# Altium project CAN_ANAL.PrjPcb
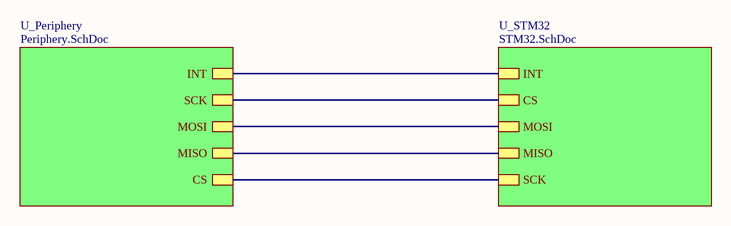
[diagram p0: main.SchDoc]
3 sheets, 55 parts. Net scope: hierarchical (ports join the sheet entries above them; power ports are global).
Board file: PCB1.PcbDoc
Sheets:
  main.SchDoc
    U_STM32 = STM32.SchDoc
    U_Periphery = Periphery.SchDoc

## Sheet main.SchDoc
size A4; SheetNumber: 1; SheetTotal: 3

### Sub-sheets
U_Periphery = Periphery.SchDoc: CS, MISO, MOSI, SCK, INT
U_STM32 = STM32.SchDoc: SCK, MISO, MOSI, CS, INT

### Nets
CS: sheet U_STM32/SCK, sheet U_Periphery/CS
INT: sheet U_STM32/INT, sheet U_Periphery/INT
MISO: sheet U_STM32/MISO, sheet U_Periphery/MISO
MOSI: sheet U_STM32/MOSI, sheet U_Periphery/MOSI
SCK: sheet U_STM32/CS, sheet U_Periphery/SCK

## Sheet STM32.SchDoc
size A4; SheetNumber: 2; SheetTotal: 3
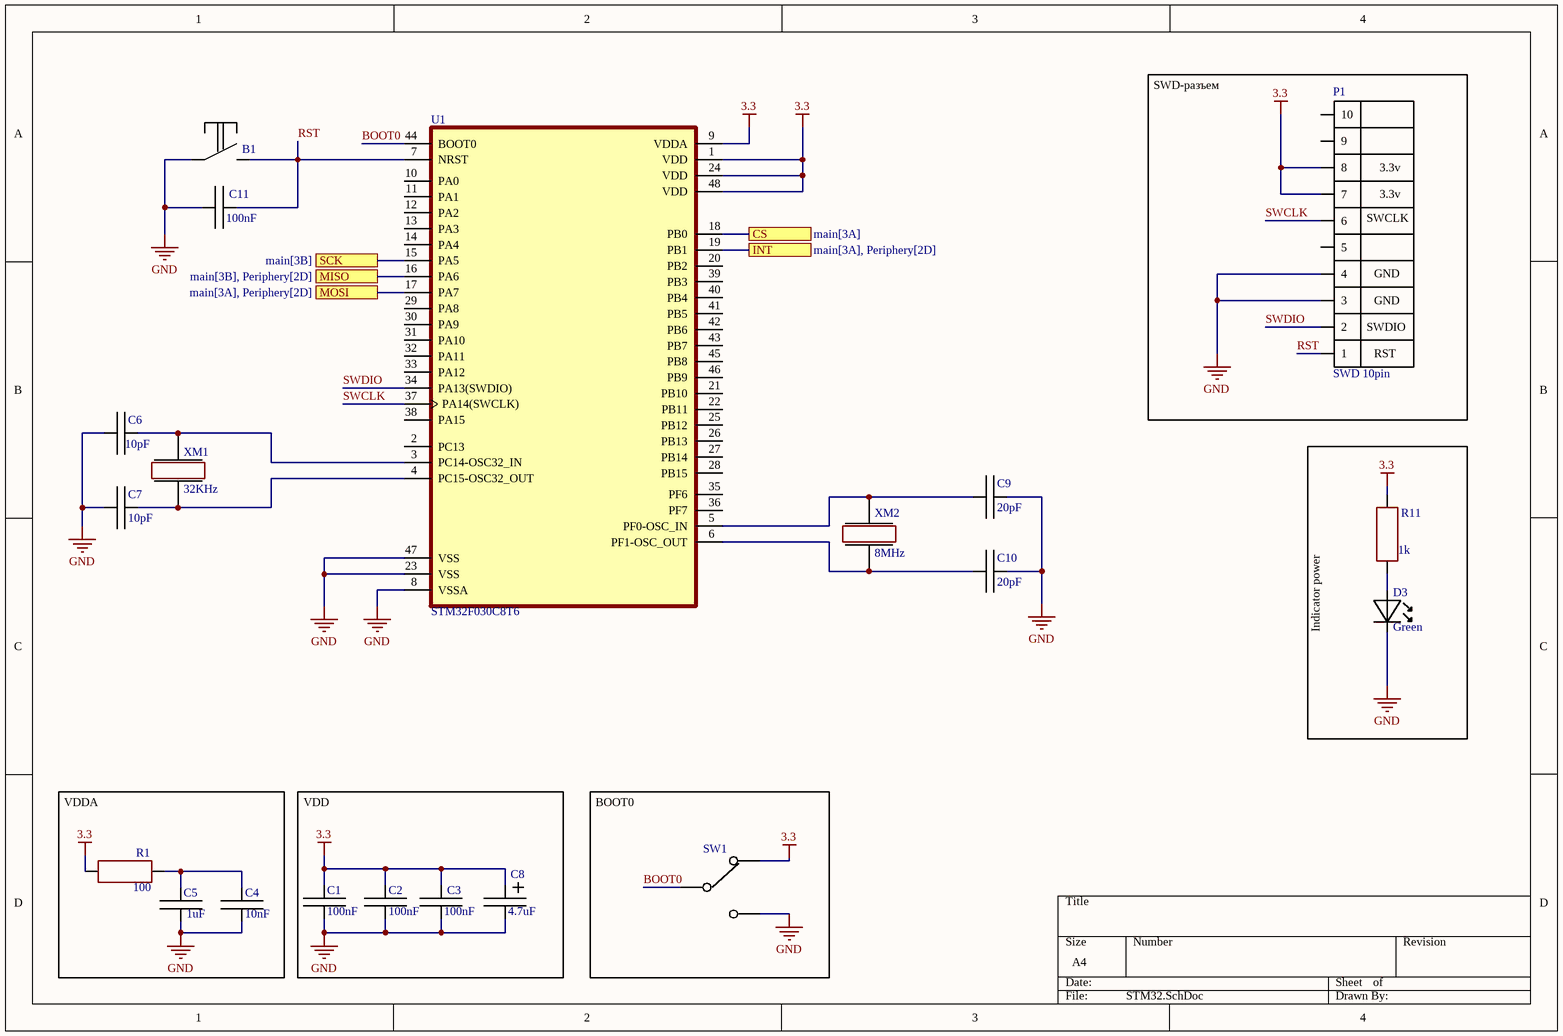
[diagram p1: STM32.SchDoc]

### Parts
B1  Knopka  [knopka]  (value not drawn)
C1  100nF  [C0805]
C2  100nF  [C0805]
C3  100nF  [C0805]
C4  10nF  [C0805]
C5  1uF  [C0805]
C6  10pF  [C0805]
C7  10pF  [C0805]
C8  4.7uF  [CAP_3.5 (8x12мм)]
C9  20pF  [C0805]
C10  20pF  [C0805]
C11  100nF  [C0805]
D3  Green  [LED0805]
P1  SWD 10pin  [SWD 10 pin]
R1  100  [R0805]
R11  1k  [R0805]
SW1  SW1  [PLS3]  (value not drawn)
U1  STM32F030C8T6  [STM32F030C8T6]
XM1  32KHz  [Resonator]
XM2  8MHz  [Resonator]

### Blocks framed on the sheet
Indicator power: D3 R11
VDDA: C4 C5 R1
VDD: C1-C3 C8
BOOT0: SW1

### Ports
CS (see main[3A]), INT (see main[3A], Periphery[2D]), MISO (see main[3B], Periphery[2D]), MOSI (see main[3A], Periphery[2D]), SCK (see main[3B])

### Nets
3.3: C1.2 C2.2 C3.2 C8.1 P1.7 P1.8 R1.2 R11.2 SW1.1 U1.1(VDD) U1.9(VDDA) U1.24(VDD) U1.48(VDD)
GND: B1.1 C1.1 C2.1 C3.1 C4.1 C5.1 C6.1 C7.1 C8.2 C9.2 C10.2 C11.1 D3.C P1.3 P1.4 SW1.3 U1.8(VSSA) U1.23(VSS) U1.47(VSS)
BOOT0: SW1.2 U1.44(BOOT0)
CS: U1.15(PA5) ; port SCK
INT: U1.19(PB1) ; port INT
MISO: U1.16(PA6) ; port MISO
MOSI: U1.17(PA7) ; port MOSI
RST: B1.2 C11.2 P1.1 U1.7(NRST)
SCK: U1.18(PB0) ; port CS
SWCLK: P1.6 U1.37(PA14(SWCLK))
SWDIO: P1.2 U1.34(PA13(SWDIO))
NetC4_2: C4.2 C5.2 R1.1
NetC6_2: C6.2 U1.3(PC14-OSC32_IN) XM1.2
NetC7_2: C7.2 U1.4(PC15-OSC32_OUT) XM1.1
NetC9_1: C9.1 U1.5(PF0-OSC_IN) XM2.2
NetC10_1: C10.1 U1.6(PF1-OSC_OUT) XM2.1
NetD3_A: D3.A R11.1

Not connected (* = marked no-connect by the designer): P1 5 9 10; U1 2(PC13) 10(PA0) 11(PA1) 12(PA2) 13(PA3) 14(PA4) 20(PB2) 21(PB10) 22(PB11) 25(PB12) 26(PB13) 27(PB14) 28(PB15) 29(PA8) 30(PA9) 31(PA10) 32(PA11) 33(PA12) 35(PF6) 36(PF7) 38(PA15) 39(PB3) 40(PB4) 41(PB5) 42(PB6) 43(PB7) 45(PB8) 46(PB9)

### Notes on the sheet
- SWD-разъем
- (near P1) 3.3v
- (near P1) SWCLK
- (near P1) GND
- (near P1) SWDIO
- (near P1) RST

### Library data of the parts
B1 = Knopka: SMD
C1-C7 C9-C11 = C0805: Керамический конденсатор. 1uF,10uF,106uF,33pF,100uF
C8 = C_3.5: Электролит конденсатор (8x12мм)
D3 = Led: SMD 0805
R1 R11 = R0805: SMD
SW1 = PLS3: для джампера
XM1 XM2 = Resonator

## Sheet Periphery.SchDoc
size A4; SheetNumber: 3; SheetTotal: 3
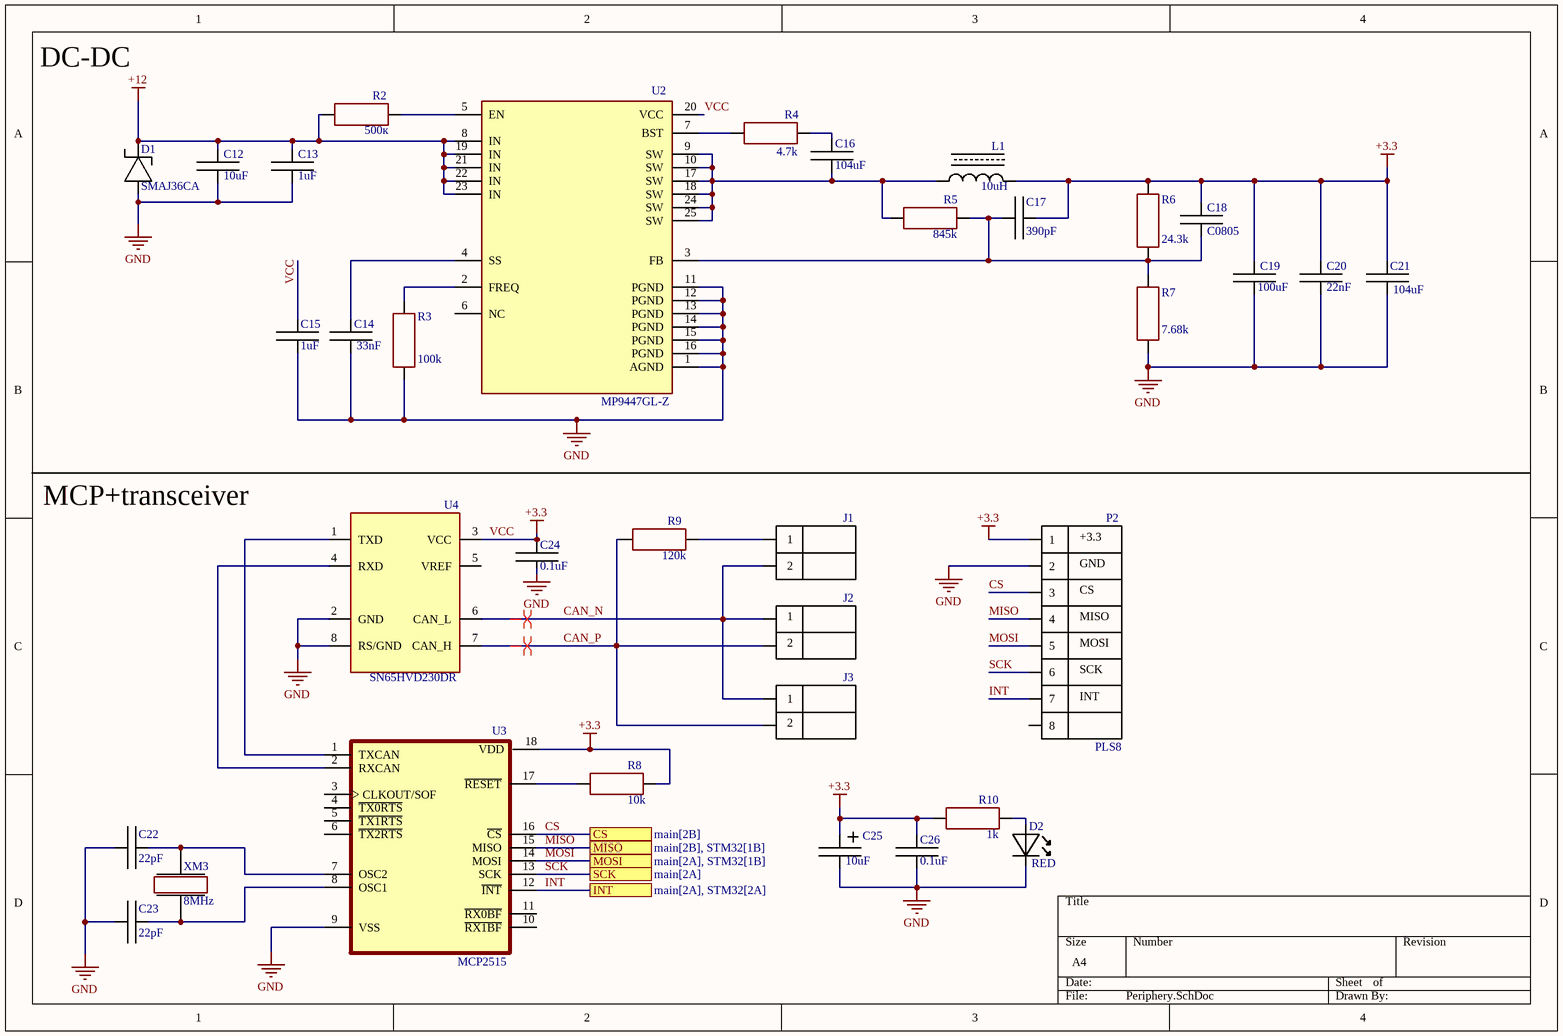
[diagram p2: Periphery.SchDoc]

### Parts
C12  10uF  [C0805]
C13  1uF  [C0805]
C15  1uF  [C0805]
C16  104uF  [C0805]
C17  390pF  [C0805]
C18  C0805  [C0805]
C19  100uF  [C0805]
C20  22nF  [C0805]
C21  104uF  [C0805]
C22  22pF  [C0805]
C23  22pF  [C0805]
C24  0.1uF  [C0805]
C25  10uF  [CAP_3.5 (8x12мм)]
C26  0.1uF  [C0805]
D1  SMAJ36CA  [SMAJ36CA]
D2  RED  [LED0805]
J1  PLS2  (value not drawn)
J2  PLS2  (value not drawn)
J3  PLS2  (value not drawn)
L1  10uH  [Inductor 10uH 8A]
P2  PLS8  [PLS8]
R2  500к  [R0805]
R3  100k  [R0805]
R4  4.7k  [R0805]
R5  845k  [R0805]
R6  24.3k  [R0805]
R7  7.68k  [R0805]
R8  10k  [R0805]
R9  120k  [R0805]
R10  1k  [R0805]
U2  MP9447GL-Z  [MP9447GL-Z]
U3  MCP2515  [MCP2515]
U4  SN65HVD230DR  [SN65HVD230DR]
XM3  8MHz  [Resonator]
С14  33nF  [C0805]

### Ports
CS (see main[2B]), INT (see main[2A], STM32[2A]), MISO (see main[2B], STM32[1B]), MOSI (see main[2A], STM32[1B]), SCK (see main[2A])

### Nets
+12: C12.2 C13.2 D1.2 R2.1 U2.8(IN) U2.19(IN) U2.21(IN) U2.22(IN) U2.23(IN)
GND: C12.1 C13.1 C15.1 C19.1 C20.1 C21.1 C22.1 C23.1 C24.1 C25.2 C26.1 D1.1 D2.C P2.2 R3.1 R7.1 U2.1(AGND) U2.11(PGND) U2.12(PGND) U2.13(PGND) U2.14(PGND) U2.15(PGND) U2.16(PGND) U3.9(VSS) U4.2(GND) U4.8(RS/GND) С14.1
VCC: C15.2 C17.2 C18.2 C19.2 C20.2 C21.2 C24.2 C25.1 C26.2 L1.1 P2.1 R6.2 R8.2 R10.1 U2.20(VCC) U3.18(VDD) U4.3(VCC)  [also labelled +3.3]
CAN_N: J1.1 J2.2 J3.2 U4.6(CAN_L)
CAN_P: J2.1 J3.1 R9.1 U4.7(CAN_H)
CS: P2.3 U3.16(~{CS}) ; port CS
INT: P2.7 U3.12(~{INT}) ; port INT
MISO: P2.4 U3.15(MISO) ; port MISO
MOSI: P2.5 U3.14(MOSI) ; port MOSI
SCK: P2.6 U3.13(SCK) ; port SCK
NetC16_1: C16.1 L1.2 R5.1 U2.9(SW) U2.10(SW) U2.17(SW) U2.18(SW) U2.24(SW) U2.25(SW)
NetC16_2: C16.2 R4.2
NetC17_1: C17.1 C18.1 R5.2 R6.1 R7.2 U2.3(FB)
NetC22_2: C22.2 U3.7(OSC2) XM3.2
NetC23_2: C23.2 U3.8(OSC1) XM3.1
NetD2_A: D2.A R10.2
NetJ1_2: J1.2 R9.2
NetR2_2: R2.2 U2.5(EN)
NetR3_2: R3.2 U2.2(FREQ)
NetR4_1: R4.1 U2.7(BST)
NetR8_1: R8.1 U3.17(~{RESET})
NetU2_4: U2.4(SS) С14.2
NetU3_1: U3.1(TXCAN) U4.1(TXD)
NetU3_2: U3.2(RXCAN) U4.4(RXD)

Not connected (* = marked no-connect by the designer): P2 8; U2 6(NC); U3 3(CLKOUT/SOF) 4(~{TX0RTS}) 5(~{TX1RTS}) 6(~{TX2RTS}) 10(~{RX1BF}) 11(~{RX0BF}); U4 5(VREF)

### Layout directives
differential pair: CAN_N, CAN_P

### Notes on the sheet
- DC-DC
- MCP+transceiver
- (near J1) 1
- (near J1) 2
- (near P2) +3.3
- (near P2) GND
- (near J2) 1
- (near J2) 2
- (near P2) CS
- (near P2) MISO
- (near P2) MOSI
- (near J3) 1
- (near P2) SCK
- (near P2) INT
- (near J3) 2

### Library data of the parts
C12 C13 C15-C24 C26 С14 = C0805: as C1 on sheet STM32
C25 = C_3.5: Электролит конденсатор (8x12мм)
D1 = SMAJ36CA: TVS-диод (Transient Voltage Suppressor)Рабочее напряжение (stand-off): 36 В / Пробой: ~40–44 В / Ограничение (clamping): ~58 В / Импульсная мощность: 400 Вт / Тип: двунаправленный (CA)
D2 = Led: SMD 0805
L1 = Inductor SMD: Катушка индуктивности SMD экранированная 10мкГн +20% 6,8A 36,5мОм 4040 лента на катушке. name-IHLP4040DZER100M01
R2-R10 = R0805: SMD
U2 = MP9447GL-Z: Микросхема понижающего импульсного стабилизатора напряжения (Buck Switching Regulator IC), регулировка положительного напряжения 0,8 В, 1 выход, 5 А, 20-VFQFN, открытая контактная площадка.
U3 = MCP2515: MCP2515-I/SO
U4 = SN65HVD230DR: трансивер, 1Мбит/с, 3-3,6ВDC, SO8
XM3 = Resonator

## Nets that join several sheets
GND: STM32 (19 pins), Periphery (27 pins)
CS: STM32 (U1.15), Periphery (P2.3 U3.16)
INT: STM32 (U1.19), Periphery (P2.7 U3.12)
MISO: STM32 (U1.16), Periphery (P2.4 U3.15)
MOSI: STM32 (U1.17), Periphery (P2.5 U3.14)
SCK: STM32 (U1.18), Periphery (P2.6 U3.13)